# Altium schematic sheet rgb_corin.schdoc
size 320 x 178 mm
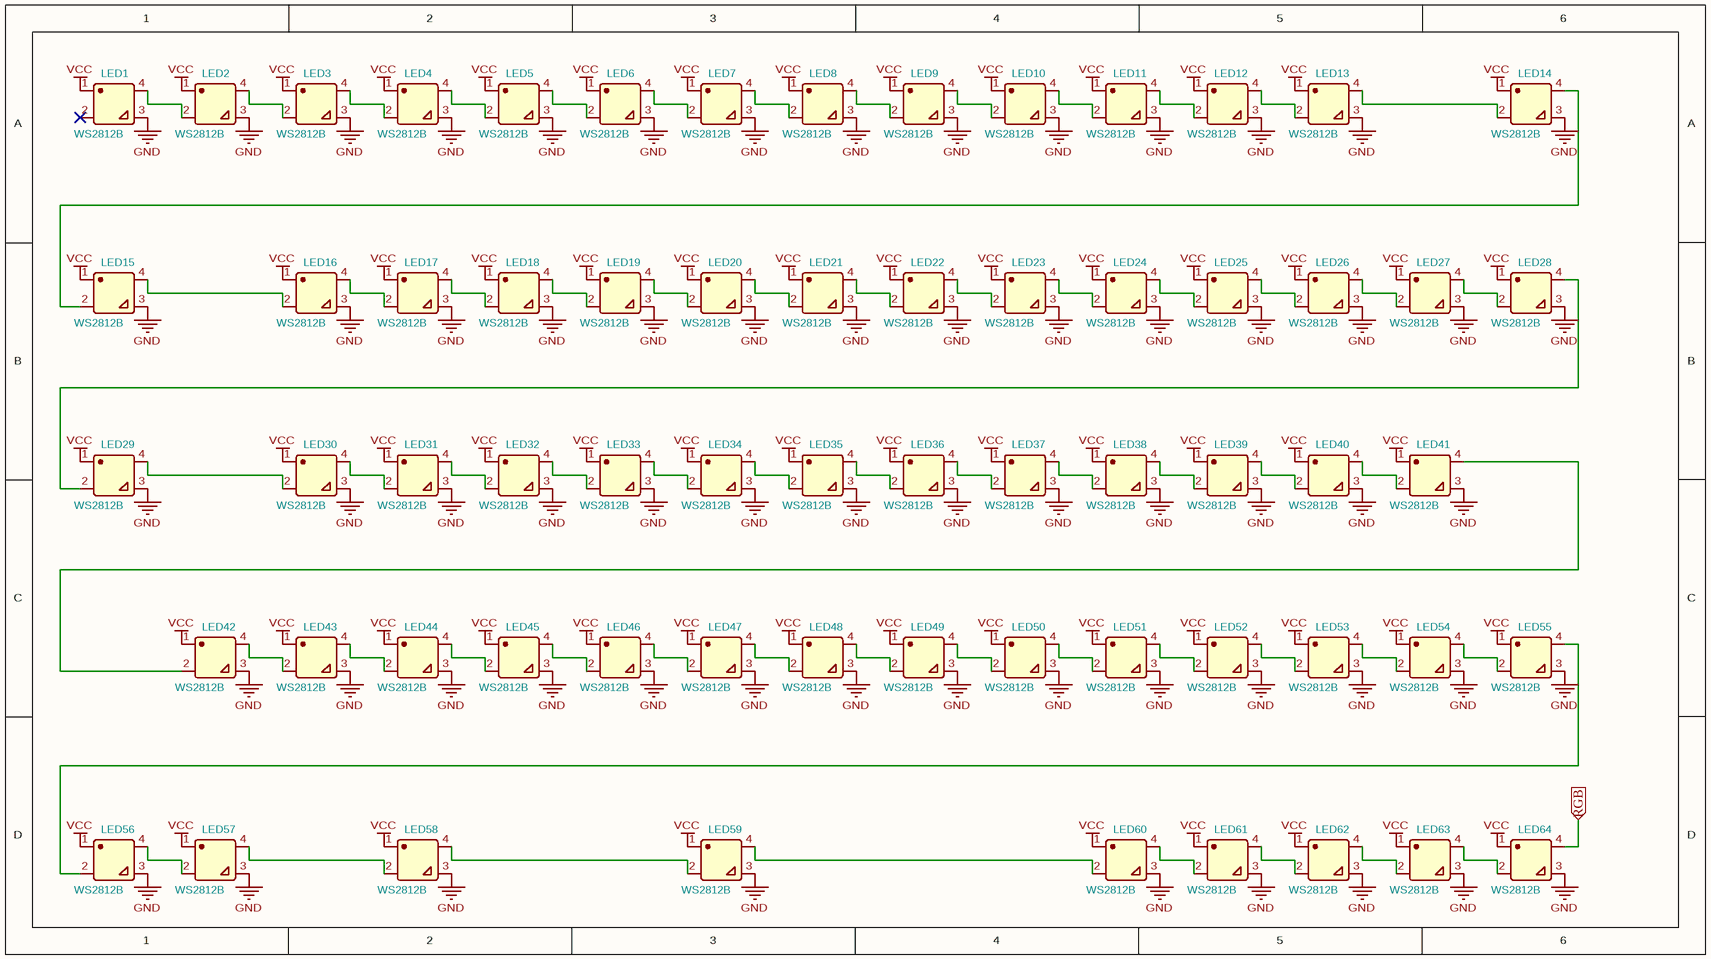
[diagram p0: rgb_corin.schdoc]

## Parts
LED1  WS2812B  [WS2812-3528]
LED2  WS2812B  [WS2812-3528]
LED3  WS2812B  [WS2812-3528]
LED4  WS2812B  [WS2812-3528]
LED5  WS2812B  [WS2812-3528]
LED6  WS2812B  [WS2812-3528]
LED7  WS2812B  [WS2812-3528]
LED8  WS2812B  [WS2812-3528]
LED9  WS2812B  [WS2812-3528]
LED10  WS2812B  [WS2812-3528]
LED11  WS2812B  [WS2812-3528]
LED12  WS2812B  [WS2812-3528]
LED13  WS2812B  [WS2812-3528]
LED14  WS2812B  [WS2812-3528]
LED15  WS2812B  [WS2812-3528]
LED16  WS2812B  [WS2812-3528]
LED17  WS2812B  [WS2812-3528]
LED18  WS2812B  [WS2812-3528]
LED19  WS2812B  [WS2812-3528]
LED20  WS2812B  [WS2812-3528]
LED21  WS2812B  [WS2812-3528]
LED22  WS2812B  [WS2812-3528]
LED23  WS2812B  [WS2812-3528]
LED24  WS2812B  [WS2812-3528]
LED25  WS2812B  [WS2812-3528]
LED26  WS2812B  [WS2812-3528]
LED27  WS2812B  [WS2812-3528]
LED28  WS2812B  [WS2812-3528]
LED29  WS2812B  [WS2812-3528]
LED30  WS2812B  [WS2812-3528]
LED31  WS2812B  [WS2812-3528]
LED32  WS2812B  [WS2812-3528]
LED33  WS2812B  [WS2812-3528]
LED34  WS2812B  [WS2812-3528]
LED35  WS2812B  [WS2812-3528]
LED36  WS2812B  [WS2812-3528]
LED37  WS2812B  [WS2812-3528]
LED38  WS2812B  [WS2812-3528]
LED39  WS2812B  [WS2812-3528]
LED40  WS2812B  [WS2812-3528]
LED41  WS2812B  [WS2812-3528]
LED42  WS2812B  [WS2812-3528]
LED43  WS2812B  [WS2812-3528]
LED44  WS2812B  [WS2812-3528]
LED45  WS2812B  [WS2812-3528]
LED46  WS2812B  [WS2812-3528]
LED47  WS2812B  [WS2812-3528]
LED48  WS2812B  [WS2812-3528]
LED49  WS2812B  [WS2812-3528]
LED50  WS2812B  [WS2812-3528]
LED51  WS2812B  [WS2812-3528]
LED52  WS2812B  [WS2812-3528]
LED53  WS2812B  [WS2812-3528]
LED54  WS2812B  [WS2812-3528]
LED55  WS2812B  [WS2812-3528]
LED56  WS2812B  [WS2812-3528]
LED57  WS2812B  [WS2812-3528]
LED58  WS2812B  [WS2812-3528]
LED59  WS2812B  [WS2812-3528]
LED60  WS2812B  [WS2812-3528]
LED61  WS2812B  [WS2812-3528]
LED62  WS2812B  [WS2812-3528]
LED63  WS2812B  [WS2812-3528]
LED64  WS2812B  [WS2812-3528]

## Ports
RGB (in)

## Nets
GND: LED1.3(VSS) LED2.3(VSS) LED3.3(VSS) LED4.3(VSS) LED5.3(VSS) LED6.3(VSS) LED7.3(VSS) LED8.3(VSS) LED9.3(VSS) LED10.3(VSS) LED11.3(VSS) LED12.3(VSS) LED13.3(VSS) LED14.3(VSS) LED15.3(VSS) LED16.3(VSS) LED17.3(VSS) LED18.3(VSS) LED19.3(VSS) LED20.3(VSS) LED21.3(VSS) LED22.3(VSS) LED23.3(VSS) LED24.3(VSS) LED25.3(VSS) LED26.3(VSS) LED27.3(VSS) LED28.3(VSS) LED29.3(VSS) LED30.3(VSS) LED31.3(VSS) LED32.3(VSS) LED33.3(VSS) LED34.3(VSS) LED35.3(VSS) LED36.3(VSS) LED37.3(VSS) LED38.3(VSS) LED39.3(VSS) LED40.3(VSS) LED41.3(VSS) LED42.3(VSS) LED43.3(VSS) LED44.3(VSS) LED45.3(VSS) LED46.3(VSS) LED47.3(VSS) LED48.3(VSS) LED49.3(VSS) LED50.3(VSS) LED51.3(VSS) LED52.3(VSS) LED53.3(VSS) LED54.3(VSS) LED55.3(VSS) LED56.3(VSS) LED57.3(VSS) LED58.3(VSS) LED59.3(VSS) LED60.3(VSS) LED61.3(VSS) LED62.3(VSS) LED63.3(VSS) LED64.3(VSS)
VCC: LED1.1(VDD) LED2.1(VDD) LED3.1(VDD) LED4.1(VDD) LED5.1(VDD) LED6.1(VDD) LED7.1(VDD) LED8.1(VDD) LED9.1(VDD) LED10.1(VDD) LED11.1(VDD) LED12.1(VDD) LED13.1(VDD) LED14.1(VDD) LED15.1(VDD) LED16.1(VDD) LED17.1(VDD) LED18.1(VDD) LED19.1(VDD) LED20.1(VDD) LED21.1(VDD) LED22.1(VDD) LED23.1(VDD) LED24.1(VDD) LED25.1(VDD) LED26.1(VDD) LED27.1(VDD) LED28.1(VDD) LED29.1(VDD) LED30.1(VDD) LED31.1(VDD) LED32.1(VDD) LED33.1(VDD) LED34.1(VDD) LED35.1(VDD) LED36.1(VDD) LED37.1(VDD) LED38.1(VDD) LED39.1(VDD) LED40.1(VDD) LED41.1(VDD) LED42.1(VDD) LED43.1(VDD) LED44.1(VDD) LED45.1(VDD) LED46.1(VDD) LED47.1(VDD) LED48.1(VDD) LED49.1(VDD) LED50.1(VDD) LED51.1(VDD) LED52.1(VDD) LED53.1(VDD) LED54.1(VDD) LED55.1(VDD) LED56.1(VDD) LED57.1(VDD) LED58.1(VDD) LED59.1(VDD) LED60.1(VDD) LED61.1(VDD) LED62.1(VDD) LED63.1(VDD) LED64.1(VDD)
RGB: LED64.4(DIN) ; port RGB
NetLED1_4: LED1.4(DIN) LED2.2(DOUT)
NetLED2_4: LED2.4(DIN) LED3.2(DOUT)
NetLED3_4: LED3.4(DIN) LED4.2(DOUT)
NetLED4_4: LED4.4(DIN) LED5.2(DOUT)
NetLED5_4: LED5.4(DIN) LED6.2(DOUT)
NetLED6_4: LED6.4(DIN) LED7.2(DOUT)
NetLED7_4: LED7.4(DIN) LED8.2(DOUT)
NetLED8_4: LED8.4(DIN) LED9.2(DOUT)
NetLED9_4: LED9.4(DIN) LED10.2(DOUT)
NetLED10_4: LED10.4(DIN) LED11.2(DOUT)
NetLED11_4: LED11.4(DIN) LED12.2(DOUT)
NetLED12_4: LED12.4(DIN) LED13.2(DOUT)
NetLED13_4: LED13.4(DIN) LED14.2(DOUT)
NetLED14_4: LED14.4(DIN) LED15.2(DOUT)
NetLED15_4: LED15.4(DIN) LED16.2(DOUT)
NetLED16_4: LED16.4(DIN) LED17.2(DOUT)
NetLED17_4: LED17.4(DIN) LED18.2(DOUT)
NetLED18_4: LED18.4(DIN) LED19.2(DOUT)
NetLED19_4: LED19.4(DIN) LED20.2(DOUT)
NetLED20_4: LED20.4(DIN) LED21.2(DOUT)
NetLED21_4: LED21.4(DIN) LED22.2(DOUT)
NetLED22_4: LED22.4(DIN) LED23.2(DOUT)
NetLED23_4: LED23.4(DIN) LED24.2(DOUT)
NetLED24_4: LED24.4(DIN) LED25.2(DOUT)
NetLED25_4: LED25.4(DIN) LED26.2(DOUT)
NetLED26_4: LED26.4(DIN) LED27.2(DOUT)
NetLED27_4: LED27.4(DIN) LED28.2(DOUT)
NetLED28_4: LED28.4(DIN) LED29.2(DOUT)
NetLED29_4: LED29.4(DIN) LED30.2(DOUT)
NetLED30_4: LED30.4(DIN) LED31.2(DOUT)
NetLED31_4: LED31.4(DIN) LED32.2(DOUT)
NetLED32_4: LED32.4(DIN) LED33.2(DOUT)
NetLED33_4: LED33.4(DIN) LED34.2(DOUT)
NetLED34_4: LED34.4(DIN) LED35.2(DOUT)
NetLED35_4: LED35.4(DIN) LED36.2(DOUT)
NetLED36_4: LED36.4(DIN) LED37.2(DOUT)
NetLED37_4: LED37.4(DIN) LED38.2(DOUT)
NetLED38_4: LED38.4(DIN) LED39.2(DOUT)
NetLED39_4: LED39.4(DIN) LED40.2(DOUT)
NetLED40_4: LED40.4(DIN) LED41.2(DOUT)
NetLED41_4: LED41.4(DIN) LED42.2(DOUT)
NetLED42_4: LED42.4(DIN) LED43.2(DOUT)
NetLED43_4: LED43.4(DIN) LED44.2(DOUT)
NetLED44_4: LED44.4(DIN) LED45.2(DOUT)
NetLED45_4: LED45.4(DIN) LED46.2(DOUT)
NetLED46_4: LED46.4(DIN) LED47.2(DOUT)
NetLED47_4: LED47.4(DIN) LED48.2(DOUT)
NetLED48_4: LED48.4(DIN) LED49.2(DOUT)
NetLED49_4: LED49.4(DIN) LED50.2(DOUT)
NetLED50_4: LED50.4(DIN) LED51.2(DOUT)
NetLED51_4: LED51.4(DIN) LED52.2(DOUT)
NetLED52_4: LED52.4(DIN) LED53.2(DOUT)
NetLED53_4: LED53.4(DIN) LED54.2(DOUT)
NetLED54_4: LED54.4(DIN) LED55.2(DOUT)
NetLED55_4: LED55.4(DIN) LED56.2(DOUT)
NetLED56_4: LED56.4(DIN) LED57.2(DOUT)
NetLED57_4: LED57.4(DIN) LED58.2(DOUT)
NetLED58_4: LED58.4(DIN) LED59.2(DOUT)
NetLED59_4: LED59.4(DIN) LED60.2(DOUT)
NetLED60_4: LED60.4(DIN) LED61.2(DOUT)
NetLED61_4: LED61.4(DIN) LED62.2(DOUT)
NetLED62_4: LED62.4(DIN) LED63.2(DOUT)
NetLED63_4: LED63.4(DIN) LED64.2(DOUT)

Not connected (* = marked no-connect by the designer): LED1 2(DOUT)*

## Library data of the parts
LED1 LED3-LED64 = WS2812B: Contributor: Longnald; SMT Type: Extend; BOM_LCSC Assembly: Yes; spicePre: L; spiceSymbolName: WS2812E
LED2 = WS2812B: Contributor: Longnald; SMT Type: Extend; Package Display: No; BOM_LCSC Assembly: Yes; spicePre: L; spiceSymbolName: WS2812E